# Altium schematic sheet MainBoard_V100_PSU_AFE.SchDoc
size A4; SheetNumber: 6; SheetTotal: 22; Title_: Analog Power Supply
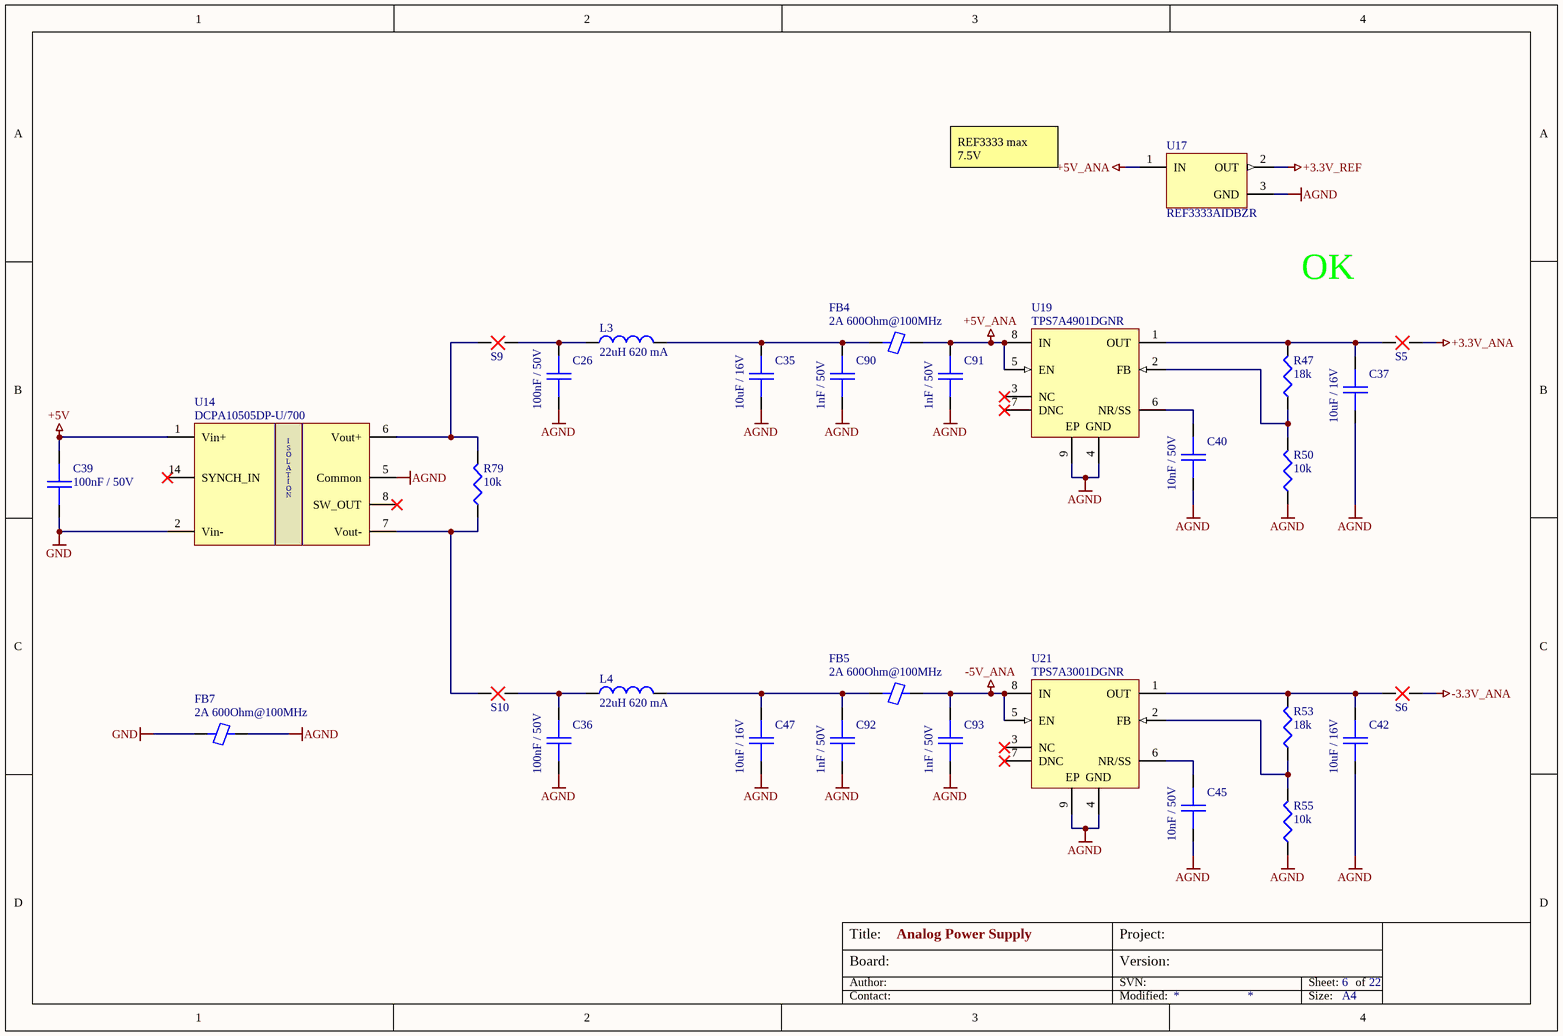
[diagram p0: MainBoard_V100_PSU_AFE.SchDoc]

## Parts
C26  100nF / 50V  [0805_C]
C35  10uF / 16V  [0805_C]
C36  100nF / 50V  [0805_C]
C37  10uF / 16V  [0805_C]
C39  100nF / 50V  [0805_C]
C40  10nF / 50V  [0805_C]
C42  10uF / 16V  [0805_C]
C45  10nF / 50V  [0805_C]
C47  10uF / 16V  [0805_C]
C90  1nF / 50V  [0805_C]
C91  1nF / 50V  [0805_C]
C92  1nF / 50V  [0805_C]
C93  1nF / 50V  [0805_C]
FB4  2A 600Ohm@100MHz  [0805_FB]
FB5  2A 600Ohm@100MHz  [0805_FB]
FB7  2A 600Ohm@100MHz  [0805_FB]
L3  22uH 620 mA  [1210]
L4  22uH 620 mA  [1210]
R47  18k  [0805]
R50  10k  [0805]
R53  18k  [0805]
R55  10k  [0805]
R79  10k  [0805]
S5  SPLITER  [SPLITER2_30mil_9mil]  (value not drawn)  (no BOM)
S6  SPLITER  [SPLITER2_30mil_9mil]  (value not drawn)  (no BOM)
S9  SPLITER  [SPLITER2_30mil_9mil]  (value not drawn)  (no BOM)
S10  SPLITER  [SPLITER2_30mil_9mil]  (value not drawn)  (no BOM)
U14  DCPA10505DP-U/700  [SOP-7]
U17  REF3333AIDBZR  [SOT-23]
U19  TPS7A4901DGNR  [MSOP-8 TP]
U21  TPS7A3001DGNR  [MSOP-8 TP]

## Nets
+3.3V_ANA: S5.2
+3.3V_REF: U17.2(OUT)
+5V: C39.1 U14.1(Vin+)
+5V_ANA: C91.1 FB4.2 U17.1(IN) U19.5(EN) U19.8(IN)
-3.3V_ANA: S6.2
-5V_ANA: C93.1 FB5.2 U21.5(EN) U21.8(IN)
AGND: C26.2 C35.2 C36.2 C37.1 C40.2 C42.1 C45.2 C47.2 C90.2 C91.2 C92.2 C93.2 FB7.2 R50.1 R55.1 U14.5(Common) U17.3(GND) U19.4(GND) U19.9(EP) U21.4(GND) U21.9(EP)
GND: C39.2 FB7.1 U14.2(Vin-)
NetC26_1: C26.1 L3.1 S9.2
NetC35_1: C35.1 C90.1 FB4.1 L3.2
NetC36_1: C36.1 L4.1 S10.2
NetC37_2: C37.2 R47.2 S5.1 U19.1(OUT)
NetC40_1: C40.1 U19.6(NR/SS)
NetC42_2: C42.2 R53.2 S6.1 U21.1(OUT)
NetC45_1: C45.1 U21.6(NR/SS)
NetC47_1: C47.1 C92.1 FB5.1 L4.2
NetR47_1: R47.1 R50.2 U19.2(FB)
NetR53_1: R53.1 R55.2 U21.2(FB)
NetR79_1: R79.1 S10.1 U14.7(Vout-)
NetR79_2: R79.2 S9.1 U14.6(Vout+)

Not connected (* = marked no-connect by the designer): U14 8(SW_OUT)* 14(SYNCH_IN)*; U19 3(NC)* 7(DNC)*; U21 3(NC)* 7(DNC)*

## Notes on the sheet
- REF3333 max 7.5V
- OK
- Board:
- Author:
- Title:
- Project:
- SVN:
- Version:
- Sheet:
- of
- Contact:
- Modified:
- Size:
- A4
- (in symbol 402) I; S; O; L; A; T; N

## Library data of the parts
C26 C36 C39 = 149: 100nF 50V X7R; Part Number: SMD0805-100nF-50V; Azonosító: 149; Category: Passives; Subcategory: PASS_Capacitor; Supplier 1: HESTORE; Supplier 1 order number: 100.011.22
C35 C37 C42 C47 = 153: 10uF 16V X5R; Part Number: SMD0805-10uF-16V; Azonosító: 153; Category: Passives; Subcategory: PASS_Capacitor; Supplier 1: HESTORE; Supplier 1 order number: 100.344.52
C40 C45 = 146: 10nF 50V X7R; Part Number: SMD0805-10nF-50V; Azonosító: 146; Category: Passives; Subcategory: PASS_Capacitor; Supplier 1: HESTORE; Supplier 1 order number: 100.011.24
C90-C93 = 144: 1nF 50V X7R; Part Number: SMD0805-1nF-50V; Azonosító: 144; Category: Passives; Subcategory: PASS_Capacitor; Supplier 1: HESTORE; Supplier 1 order number: 100.200.70
FB4 FB5 FB7 = 183: Ferrite bead 2A 600Ohm@100MHz; Part Number: LCBB-601 SMD; Azonosító: 183; Category: Passives; Subcategory: PASS_Other; Supplier 1: HESTORE; Supplier 1 order number: 100.327.86
L3 L4 = 387: 22uH 620 mA 1210; Part Number: CBC3225T220KR; Azonosító: 387; Category: Passives; Subcategory: PASS_Inductor; Supplier 1: MOUSER; Supplier 1 order number: 963-CBC3225T220KR; Help URL: https://hu.mouser.com/datasheet/2/396/wound02_e-2256580.pdf
R47 R53 = 406: 18k 0805 0.125W 1%; Part Number: SMD0805-18K-1%; Azonosító: 406; Category: Passives; Subcategory: PASS_Resistor; Supplier 1: HESTORE; Supplier 1 order number: 100.437.83
R50 R55 R79 = 59: 10k 0805 0.125W 1%; Part Number: SMD0805-10k 1%; Azonosító: 59; Category: Passives; Subcategory: PASS_Resistor; Supplier 1: HESTORE; Supplier 1 order number: 100.403.38
S5 S6 S9 S10 = 272: SPLITER2_30mil_9mil; Azonosító: 272; Part Number: SPLITER2_30mil_9mil; Category: Accessories; Subcategory: ACCE_Other
U14 = 402: Isolated DC/DC Converter, Vin = 5V, Vout = +/-5V, 1W, Isolated Unregulated,  7-SOP; Azonosító: 402; Part Number: DCPA10505DP-U/700; Category: Integrated Circuits; Subcategory: IC_Power; Supplier 1: MOUSER; Supplier 1 order number: 595-DCPA10505DPU/700; Help URL: https://www.ti.com/lit/ds/symlink/dcpa10505d.pdf?ts=1710773135857&ref_url=https%253A%252F%252Fhu.mouser.com%252F
U17 = 363: VOLTAGE REF, SERIES, 3.3V, SOT-23-3 ,0.15 %,30ppm/°C; Azonosító: 363; Part Number: REF3333AIDBZR; Category: Semiconductors; Subcategory: IC_Power; Supplier 1: MOUSER; Supplier 1 order number: 595-REF3333AIDBZR; Supplier 2: FARNELL; Supplier 2 order number: 3124553; Help URL: https://www.ti.com/lit/ds/symlink/ref3333.pdf?ts=1704361235069&ref_url=https%253A%252F%252Fhu.mouser.com%252F
U19 = 385: LDO Voltage Regulator, Adjustable, 3 V to 35 V in, 333 mV drop, 1.194 V to 33 V/150 mA out, MSOP-8; Azonosító: 385; Part Number: TPS7A4901DGNR; Category: Integrated Circuits; Subcategory: IC_Power; Supplier 1: MOUSER; Supplier 1 order number: 595-TPS7A4901DGNR; Help URL: https://www.ti.com/lit/ds/symlink/tps7a49.pdf?ts=1708810798586
U21 = 386: LDO Voltage Regulators -3V to -36V,-200mA High PSRR, LDO Reg; Azonosító: 386; Part Number: TPS7A3001DGNR; Category: Integrated Circuits; Subcategory: IC_Power; Supplier 1: MOUSER; Supplier 1 order number: 595-TPS7A3001DGNR; Help URL: https://www.ti.com/lit/ds/symlink/tps7a30.pdf?ts=1708885018535&ref_url=https%253A%252F%252Fhu.mouser.com%252F